# Altium schematic sheet Main0.SchDoc
size A4; SheetNumber: 1; SheetTotal: 2
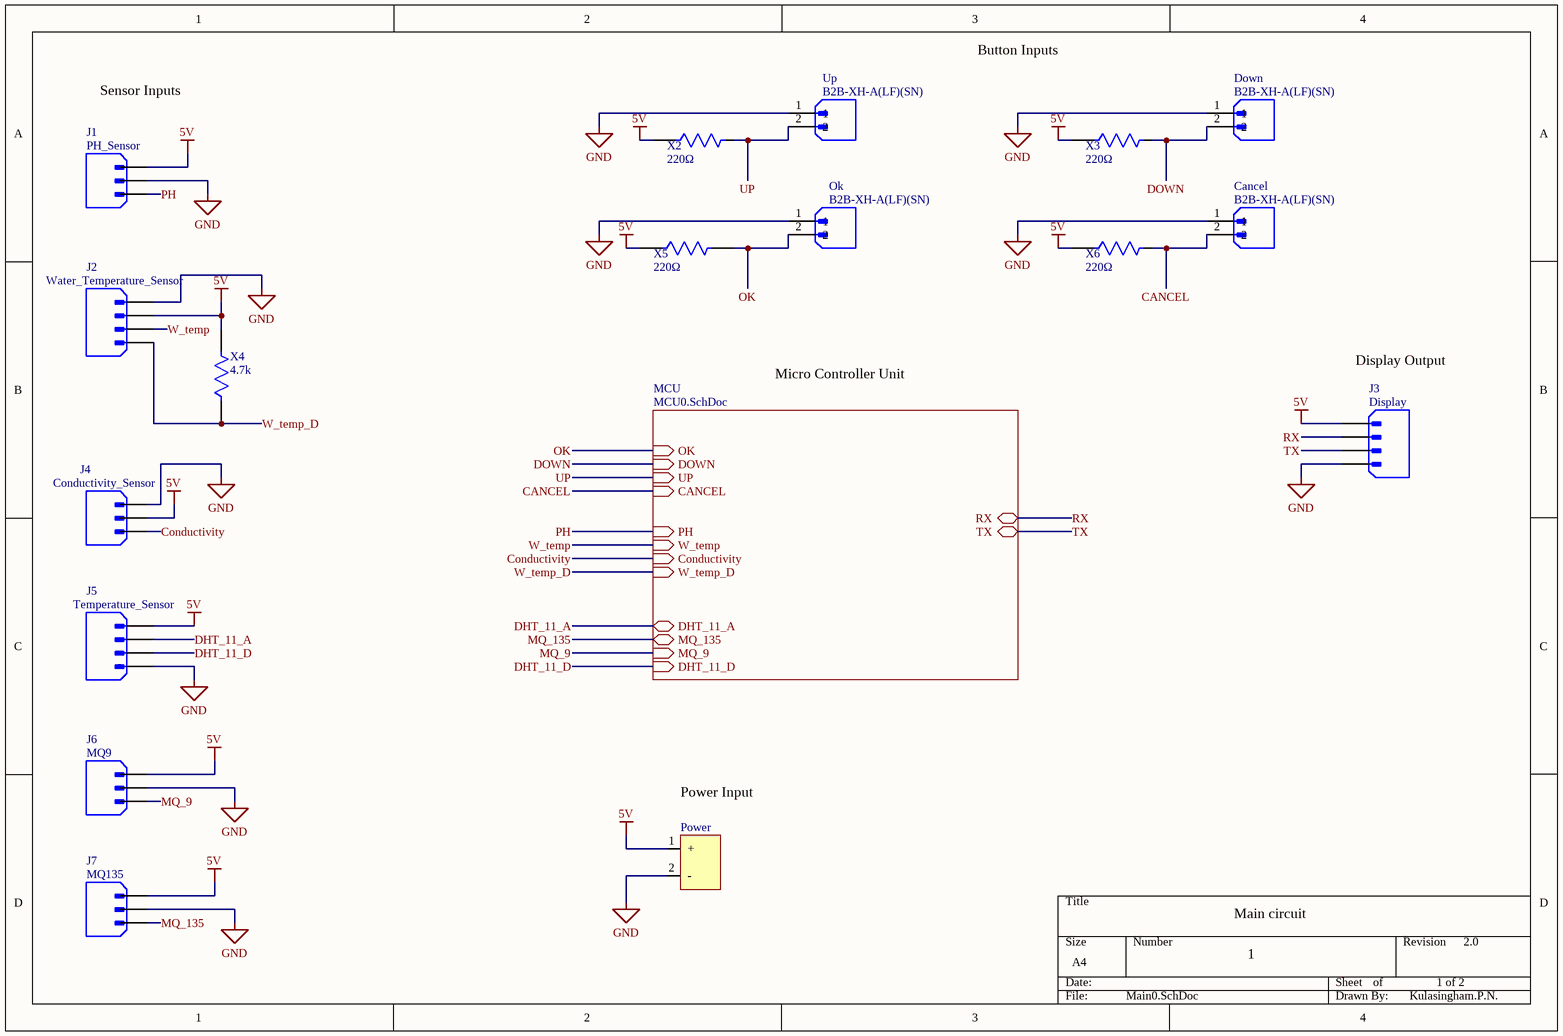
[diagram p0: Main0.SchDoc]

## Parts
Cancel  B2B-XH-A(LF)(SN)  [JST_B2B-XH-A(LF)(SN)]
Down  B2B-XH-A(LF)(SN)  [JST_B2B-XH-A(LF)(SN)]
J1  PH_Sensor  [JST_B3B-XH-A (LF)(SN)]
J2  Water_Temperature_Sensor  [JST_B4B-XH-A(LF)(SN)]
J3  Display  [JST_B4B-XH-A(LF)(SN)]
J4  Conductivity_Sensor  [JST_B3B-XH-A (LF)(SN)]
J5  Temperature_Sensor  [JST_B4B-XH-A(LF)(SN)]
J6  MQ9  [JST_B3B-XH-A (LF)(SN)]
J7  MQ135  [JST_B3B-XH-A (LF)(SN)]
Ok  B2B-XH-A(LF)(SN)  [JST_B2B-XH-A(LF)(SN)]
Power  TB006-508-02BE  [terminalbox]  (value not drawn)
Up  B2B-XH-A(LF)(SN)  [JST_B2B-XH-A(LF)(SN)]
X2  Resistance: 220Ω  [RESC3216X60N]  (hidden comment: RCC1206220RFKEA)
X3  Resistance: 220Ω  [RESC3216X60N]  (hidden comment: RCC1206220RFKEA)
X4  Resistance: 4.7k  [RESC3216X60N]  (hidden comment: RCC1206220RFKEA)
X5  Resistance: 220Ω  [RESC3216X60N]  (hidden comment: RCC1206220RFKEA)
X6  Resistance: 220Ω  [RESC3216X60N]  (hidden comment: RCC1206220RFKEA)

## Sub-sheets
MCU = MCU0.SchDoc: PH (in), W_temp (in), Conductivity (in), RX (bidir), TX (bidir), DOWN (in), UP (in), CANCEL (in), OK (in), DHT_11_A (bidir), MQ_135 (bidir), MQ_9 (in), DHT_11_D (in), W_temp_D (in)

## Nets
5V: J1.1 J2.2 J3.1 J4.2 J5.1 J6.1 J7.1 Power.1(+) X2.1 X3.1 X4.2 X5.1 X6.1
GND: Cancel.1 Down.1 J1.2 J2.1 J3.4 J4.1 J5.4 J6.2 J7.2 Ok.1 Power.2(-) Up.1
CANCEL: Cancel.2 X6.2 ; sheet MCU/CANCEL
Conductivity: J4.3 ; sheet MCU/Conductivity
DHT_11_A: J5.2 ; sheet MCU/DHT_11_A
DHT_11_D: J5.3 ; sheet MCU/DHT_11_D
DOWN: Down.2 X3.2 ; sheet MCU/DOWN
MQ_9: J6.3 ; sheet MCU/MQ_9
MQ_135: J7.3 ; sheet MCU/MQ_135
OK: Ok.2 X5.2 ; sheet MCU/OK
PH: J1.3 ; sheet MCU/PH
RX: J3.2 ; sheet MCU/RX
TX: J3.3 ; sheet MCU/TX
UP: Up.2 X2.2 ; sheet MCU/UP
W_temp: J2.3 ; sheet MCU/W_temp
W_temp_D: J2.4 X4.1 ; sheet MCU/W_temp_D

## Notes on the sheet
- Sensor Inputs
- Button Inputs
- Micro Controller Unit
- Display Output
- (near Power) Power Input
- Main circuit
- 1
- 1 of 2
- 2.0
- Kulasingham.P.N.

## Library data of the parts
Cancel Down Ok Up = B2B-XH-A(LF)(SN): Connector Header Through Hole 2 position 0.098 (2.50mm); MF: JST Sales America Inc.; SnapEDA_Link: https://www.snapeda.com/parts/B2B-XH-A(LF)(SN)/JST+Sales+America+Inc./view-part/?ref=snap; Package: None; Value: *; MP: B2B-XH-A(LF)(SN); Check_prices: https://www.snapeda.com/parts/B2B-XH-A(LF)(SN)/JST+Sales+America+Inc./view-part/?ref=eda
J1 J4 J6 J7 = B3B-XH-A_(LF)(SN): Connector Header Through Hole 3 position 0.098 (2.50mm); MF: JST Sales America Inc.; MP: B3B-XH-A (LF)(SN); SnapEDA_Link: https://www.snapeda.com/parts/B3B-XH-A%20(LF)(SN)/JST+Sales+America+Inc./view-part/?ref=snap; Package: None; Value: *; Check_prices: https://www.snapeda.com/parts/B3B-XH-A%20(LF)(SN)/JST+Sales+America+Inc./view-part/?ref=eda
J2 J3 J5 = B4B-XH-A(LF)(SN)_1: Connector Header Through Hole 4 position 0.098 (2.50mm); MF: JST Sales; SnapEDA_Link: https://www.snapeda.com/parts/B4B-XH-A(LF)(SN)/JST+Sales+America+Inc./view-part/?ref=snap; Package: None; MP: B4B-XH-A(LF)(SN); Check_prices: https://www.snapeda.com/parts/B4B-XH-A(LF)(SN)/JST+Sales+America+Inc./view-part/?ref=eda; Purchase-URL: https://pricing.snapeda.com/search/part/B4B-XH-A(LF)(SN)/?ref=eda; Price: None; Value: *; Availability: In Stock
Power = TB006-508-02BE: Barrier Strip Terminal Block; Manufacturer: CUI Devices; Supplier: Mouser; Supplier Part Number: 490-TB006-508-02BE; Manufacturer Part Number: TB006-508-02BE; RoHS: Yes; Stock: 47338; Pricing: 1=0.86, 10=0.315, 50=0.315, 100=0.301, 1000=0.21, 10000=0.175 (USD)
X2-X6 = RCC1206220RFKEA: Thick Film Resistors - SMD 220ohms 1% 100ppm; Manufacturer_Name: Vishay; Geometry.Height: 0.6mm; Mouser Part Number: 71-RCC1206220RFKEA; Mouser Price/Stock: https://www.mouser.co.uk/ProductDetail/Vishay-Dale/RCC1206220RFKEA?qs=IS%252B4QmGtzzrRn9QnSak10Q%3D%3D; Manufacturer_Part_Number: RCC1206220RFKEA; Datasheet Link: https://4donline.ihs.com/images/VipMasterIC/IC/VISH/VISH-S-A0011718072/VISH-S-A0011718072-1.pdf?hkey=6D3A4C79FDBF58556ACFDE234799DDF0